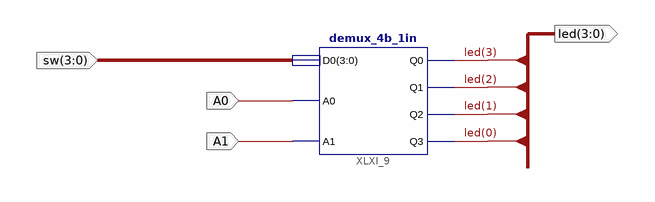
[diagram p0: schematic sheet 1]
// Xilinx ISE schematic main_sch.sch (spartan6) as structural Verilog: 1 symbols, 4 ports
module main_sch (
  input  A0,
  input  A1,
  input  [3:0] sw,
  output [3:0] led
);

  demux_4b_1in XLXI_9 (.D0(sw), .A0(A0), .A1(A1), .Q0(led[3]), .Q1(led[2]), .Q2(led[1]), .Q3(led[0]));
endmodule
